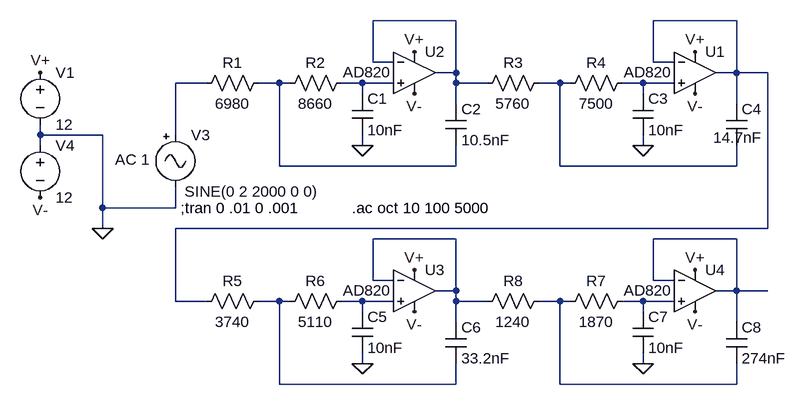
[diagram p0: schematic anti_alias_5k.asc]
anti_alias_5k.asc, the LTspice schematic file:
Version 4
SHEET 1 880 900
WIRE 240 336 112 336
WIRE 672 336 544 336
WIRE 112 400 112 336
WIRE 144 400 112 400
WIRE 544 400 544 336
WIRE 576 400 544 400
WIRE 240 416 240 336
WIRE 240 416 208 416
WIRE 672 416 672 336
WIRE 672 416 640 416
WIRE 720 416 672 416
WIRE -144 432 -192 432
WIRE -32 432 -64 432
WIRE -16 432 -32 432
WIRE 96 432 64 432
WIRE 144 432 96 432
WIRE 240 432 240 416
WIRE 288 432 240 432
WIRE 400 432 368 432
WIRE 416 432 400 432
WIRE 528 432 496 432
WIRE 576 432 528 432
WIRE 96 448 96 432
WIRE 528 448 528 432
WIRE 240 464 240 432
WIRE 672 464 672 416
WIRE -400 512 -400 496
WIRE -304 512 -400 512
WIRE -192 512 -192 432
WIRE -400 528 -400 512
WIRE 96 528 96 512
WIRE 528 528 528 512
WIRE -32 560 -32 432
WIRE 240 560 240 528
WIRE 240 560 -32 560
WIRE 400 560 400 432
WIRE 672 560 672 528
WIRE 672 560 400 560
WIRE -304 624 -304 512
WIRE -192 624 -192 592
WIRE -192 624 -304 624
WIRE -304 656 -304 624
WIRE 720 656 720 416
WIRE 720 656 -192 656
WIRE 240 672 112 672
WIRE 672 672 544 672
WIRE 112 736 112 672
WIRE 144 736 112 736
WIRE 544 736 544 672
WIRE 576 736 544 736
WIRE 240 752 240 672
WIRE 240 752 208 752
WIRE 672 752 672 672
WIRE 672 752 640 752
WIRE 720 752 672 752
WIRE -192 768 -192 656
WIRE -144 768 -192 768
WIRE -32 768 -64 768
WIRE -16 768 -32 768
WIRE 96 768 64 768
WIRE 144 768 96 768
WIRE 240 768 240 752
WIRE 288 768 240 768
WIRE 400 768 368 768
WIRE 416 768 400 768
WIRE 528 768 496 768
WIRE 576 768 528 768
WIRE 96 784 96 768
WIRE 528 784 528 768
WIRE 240 800 240 768
WIRE 672 800 672 752
WIRE 96 864 96 848
WIRE 528 864 528 848
WIRE -32 896 -32 768
WIRE 240 896 240 864
WIRE 240 896 -32 896
WIRE 400 896 400 768
WIRE 672 896 672 864
WIRE 672 896 400 896
FLAG -400 416 V+
FLAG 176 384 V+
FLAG -400 608 V-
FLAG 176 448 V-
FLAG -304 656 0
FLAG 96 528 0
FLAG 608 384 V+
FLAG 608 448 V-
FLAG 528 528 0
FLAG 176 720 V+
FLAG 176 784 V-
FLAG 96 864 0
FLAG 608 720 V+
FLAG 608 784 V-
FLAG 528 864 0
SYMBOL Misc\\signal -192 496 R0
WINDOW 123 -93 54 Left 2
WINDOW 39 0 0 Left 0
WINDOW 3 14 103 Left 2
SYMATTR Value2 AC 1
SYMATTR Value SINE(0 2 2000 0 0)
SYMATTR InstName V3
SYMBOL Opamps\\AD820 176 352 R0
WINDOW 3 -110 63 Left 2
SYMATTR InstName U2
SYMBOL voltage -400 400 R0
WINDOW 123 0 0 Left 0
WINDOW 39 0 0 Left 0
SYMATTR InstName V1
SYMATTR Value 12
SYMBOL voltage -400 512 R0
WINDOW 123 0 0 Left 0
WINDOW 39 0 0 Left 0
SYMATTR InstName V4
SYMATTR Value 12
SYMBOL res -48 416 R90
WINDOW 0 0 56 VBottom 2
WINDOW 3 32 56 VTop 2
SYMATTR InstName R1
SYMATTR Value 6980
SYMBOL res 80 416 R90
WINDOW 0 0 56 VBottom 2
WINDOW 3 32 56 VTop 2
SYMATTR InstName R2
SYMATTR Value 8660
SYMBOL cap 80 448 R0
SYMATTR InstName C1
SYMATTR Value 10nF
SYMBOL cap 224 464 R0
SYMATTR InstName C2
SYMATTR Value 10.5nF
SYMBOL Opamps\\AD820 608 352 R0
WINDOW 3 -110 63 Left 2
SYMATTR InstName U1
SYMBOL res 512 416 R90
WINDOW 0 0 56 VBottom 2
WINDOW 3 32 56 VTop 2
SYMATTR InstName R4
SYMATTR Value 7500
SYMBOL cap 512 448 R0
SYMATTR InstName C3
SYMATTR Value 10nF
SYMBOL cap 656 464 R0
WINDOW 3 -20 52 Left 2
SYMATTR InstName C4
SYMATTR Value 14.7nF
SYMBOL res 384 416 R90
WINDOW 0 0 56 VBottom 2
WINDOW 3 32 56 VTop 2
SYMATTR InstName R3
SYMATTR Value 5760
SYMBOL Opamps\\AD820 176 688 R0
WINDOW 3 -110 63 Left 2
SYMATTR InstName U3
SYMBOL res -48 752 R90
WINDOW 0 0 56 VBottom 2
WINDOW 3 32 56 VTop 2
SYMATTR InstName R5
SYMATTR Value 3740
SYMBOL res 80 752 R90
WINDOW 0 0 56 VBottom 2
WINDOW 3 32 56 VTop 2
SYMATTR InstName R6
SYMATTR Value 5110
SYMBOL cap 80 784 R0
SYMATTR InstName C5
SYMATTR Value 10nF
SYMBOL cap 224 800 R0
SYMATTR InstName C6
SYMATTR Value 33.2nF
SYMBOL Opamps\\AD820 608 688 R0
WINDOW 3 -110 63 Left 2
SYMATTR InstName U4
SYMBOL res 512 752 R90
WINDOW 0 0 56 VBottom 2
WINDOW 3 32 56 VTop 2
SYMATTR InstName R7
SYMATTR Value 1870
SYMBOL cap 512 784 R0
SYMATTR InstName C7
SYMATTR Value 10nF
SYMBOL cap 656 800 R0
SYMATTR InstName C8
SYMATTR Value 274nF
SYMBOL res 384 752 R90
WINDOW 0 0 56 VBottom 2
WINDOW 3 32 56 VTop 2
SYMATTR InstName R8
SYMATTR Value 1240
TEXT -184 624 Left 2 !;tran 0 .01 0 .001
TEXT 80 624 Left 2 !.ac oct 10 100 5000

The netlist it stands for:
* anti_alias_5k.asc
V3 N003 0 SINE(0 2 2000 0 0) AC 1
XU2 N005 N001 V+ V- N001 AD820  ; pins In+ In- V+ V- OUT
V1 V+ 0 12
V4 0 V- 12
R1 N004 N003 6980
R2 N005 N004 8660
C1 N005 0 10nF
C2 N001 N004 10.5nF
XU1 N007 N002 V+ V- N002 AD820  ; pins In+ In- V+ V- OUT
R4 N007 N006 7500
C3 N007 0 10nF
C4 N002 N006 14.7nF
R3 N006 N001 5760
XU3 N011 N008 V+ V- N008 AD820  ; pins In+ In- V+ V- OUT
R5 N010 N002 3740
R6 N011 N010 5110
C5 N011 0 10nF
C6 N008 N010 33.2nF
XU4 N013 N009 V+ V- N009 AD820  ; pins In+ In- V+ V- OUT
R7 N013 N012 1870
C7 N013 0 10nF
C8 N009 N012 274nF
R8 N012 N008 1240
;tran 0 .01 0 .001
.ac oct 10 100 5000
.backanno
.end